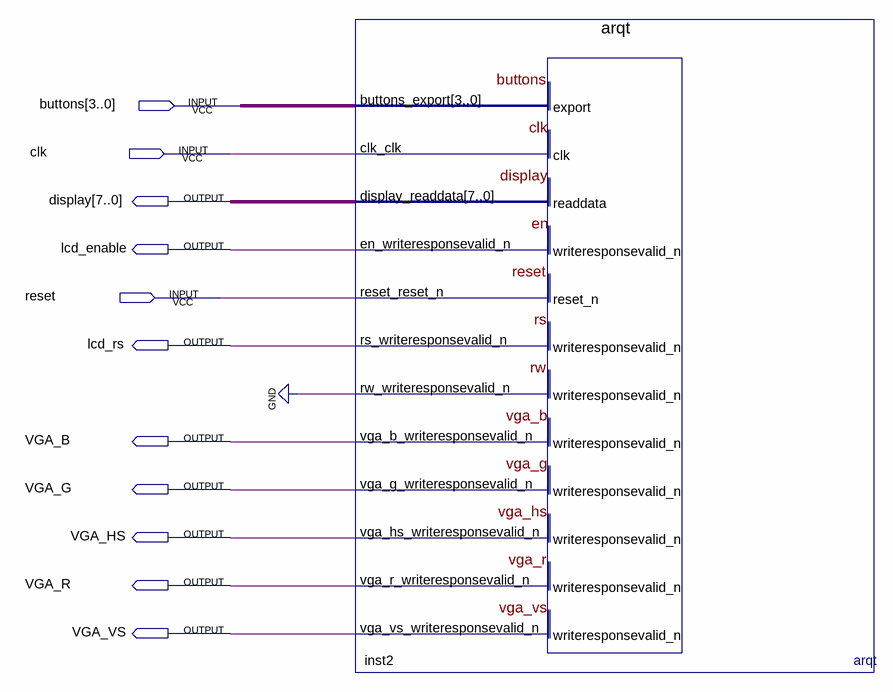
[diagram p0: schematic sheet]
// Quartus schematic problema1.bdf as structural Verilog: 1 symbols, 11 pins
module problema1 (
  input  [3:0] buttons,
  input  clk,
  input  reset,
  output [7:0] display,
  output lcd_enable,
  output lcd_rs,
  output VGA_B,
  output VGA_G,
  output VGA_HS,
  output VGA_R,
  output VGA_VS
);

  wire inst2_rw_writeresponsevalid_n;

  arqt inst2 (
    .buttons_export(buttons), .clk_clk(clk), .reset_reset_n(reset), .display_readdata(display),
    .en_writeresponsevalid_n(lcd_enable), .rs_writeresponsevalid_n(lcd_rs),
    .rw_writeresponsevalid_n(inst2_rw_writeresponsevalid_n), .vga_b_writeresponsevalid_n(VGA_B),
    .vga_g_writeresponsevalid_n(VGA_G), .vga_hs_writeresponsevalid_n(VGA_HS),
    .vga_r_writeresponsevalid_n(VGA_R), .vga_vs_writeresponsevalid_n(VGA_VS));
  // also tied to GND on the sheet: inst2_rw_writeresponsevalid_n
endmodule
